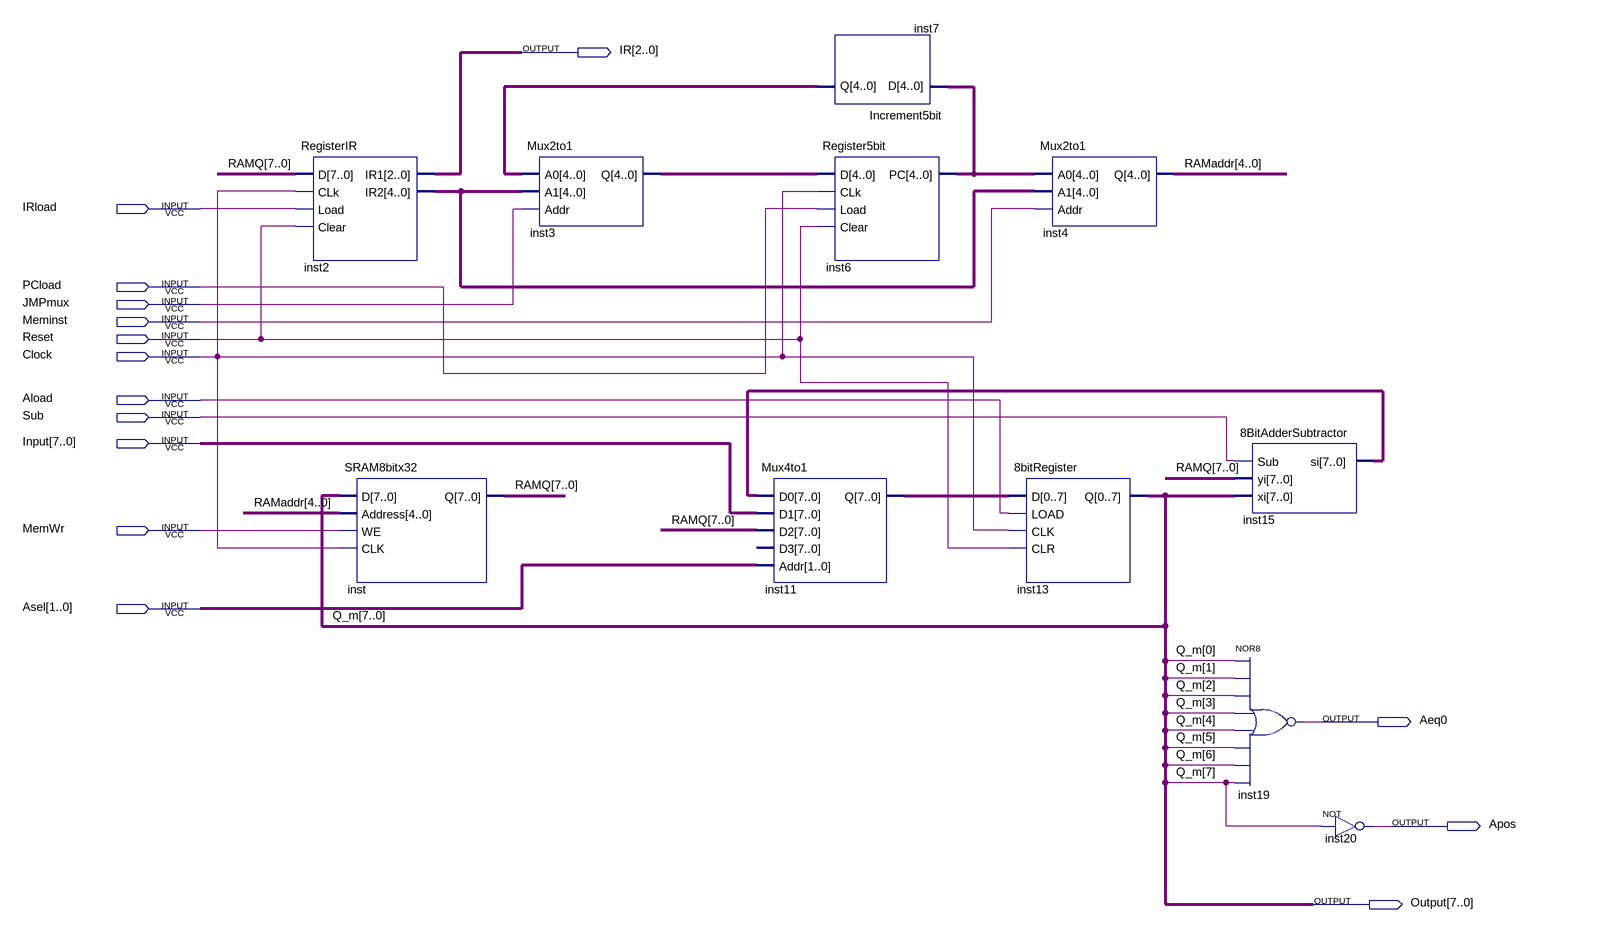
[diagram p0: schematic sheet]
// Quartus schematic DP.bdf as structural Verilog: 11 symbols, 15 pins
module DP (
  input  IRload,
  input  PCload,
  input  JMPmux,
  input  Meminst,
  input  Reset,
  input  Clock,
  input  Aload,
  input  Sub,
  input  [7:0] Input,
  input  MemWr,
  input  [1:0] Asel,
  output [2:0] IR,
  output Aeq0,
  output Apos,
  output [7:0] Output
);

  wire [4:0] inst2_ir2, inst3_q, inst6_pc, inst7_q, RAMaddr;
  wire [7:0] inst11_q, inst15_si, RAMQ;

  RegisterIR inst2 (.D(RAMQ), .CLk(Clock), .Load(IRload), .Clear(Reset), .IR1(IR), .IR2(inst2_ir2));
  SRAM8bitx32 inst (.D(Output), .Address(RAMaddr), .WE(MemWr), .CLK(Clock), .Q(RAMQ));
  Mux2to1 inst3 (.A0(inst7_q), .A1(inst2_ir2), .Addr(JMPmux), .Q(inst3_q));
  Mux4to1 inst11 (.D0(inst15_si), .D1(Input), .D2(RAMQ), .Addr(Asel), .Q(inst11_q));  // open: D3
  Increment5bit inst7 (.D(inst6_pc), .Q(inst7_q));
  Register5bit inst6 (.D(inst3_q), .CLk(Clock), .Load(PCload), .Clear(Reset), .PC(inst6_pc));
  \8bitRegister  inst13 (.D(inst11_q), .LOAD(Aload), .CLK(Clock), .CLR(Reset), .Q(Output));
  Mux2to1 inst4 (.A0(inst6_pc), .A1(inst2_ir2), .Addr(Meminst), .Q(RAMaddr));
  \8BitAdderSubtractor  inst15 (.Sub(Sub), .yi(RAMQ), .xi(Output), .si(inst15_si));
  nor inst19 (Aeq0, Output[0], Output[1], Output[2], Output[3], Output[4], Output[5], Output[6], Output[7]);
  not inst20 (Apos, Output[7]);

  // Other names for the same wires on the sheet: Q_m[7:0] = Output
endmodule
